# Altium schematic sheet LT3798.SchDoc
size A3
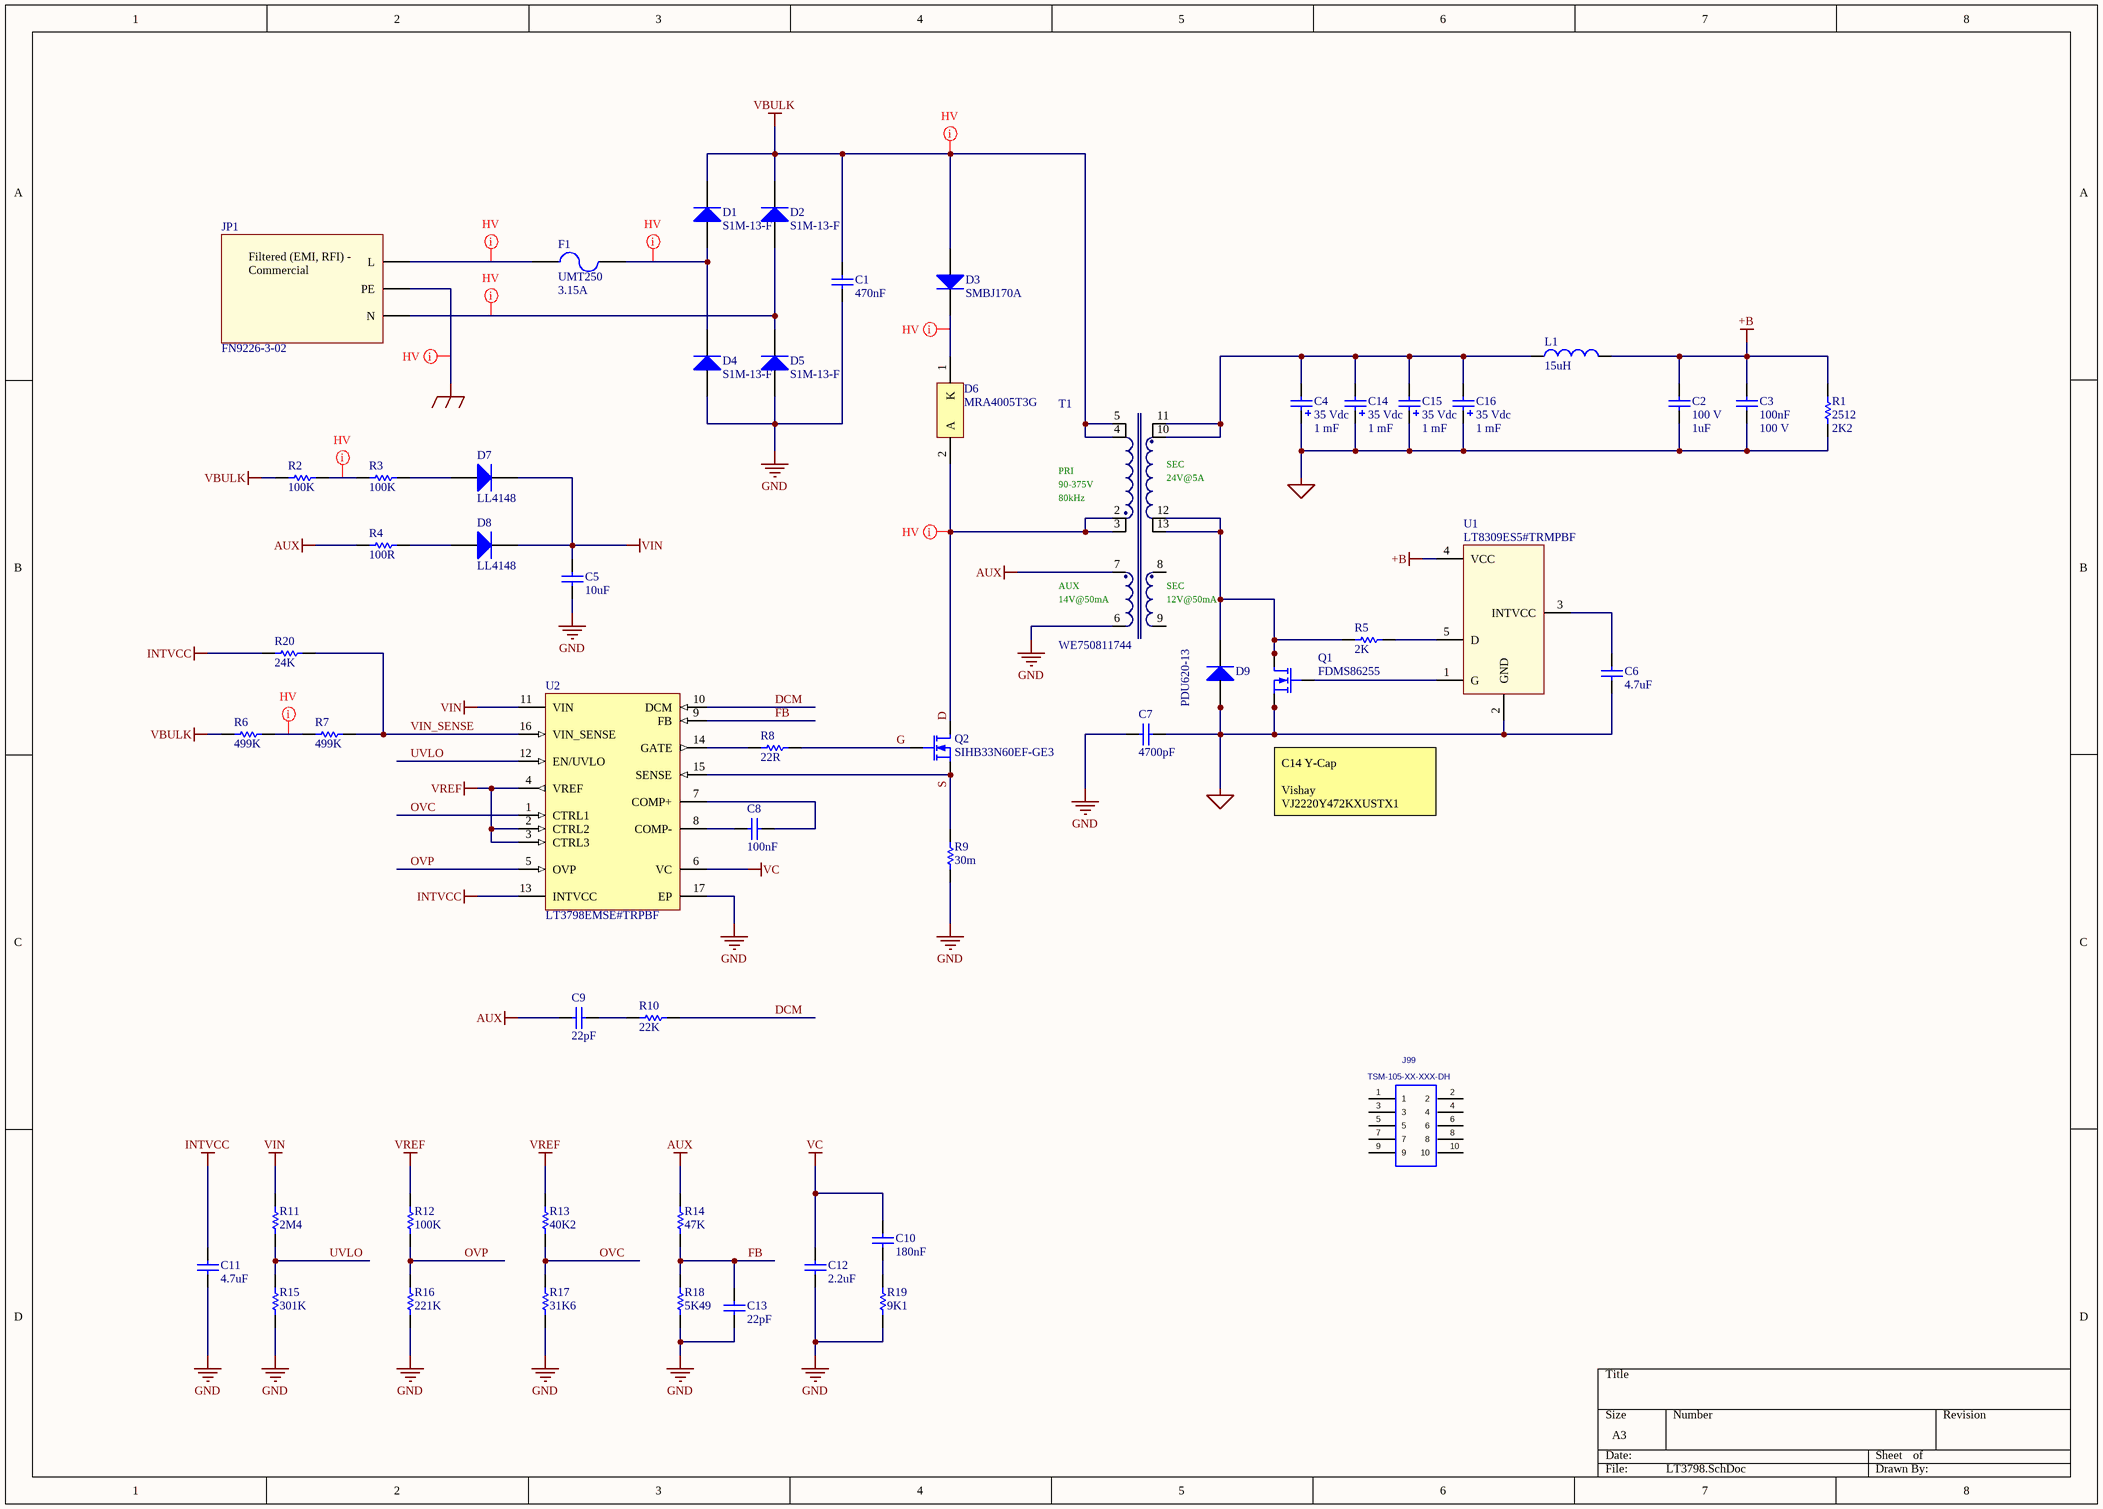
[diagram p0: LT3798.SchDoc]

## Parts
C1  470nF  [CAP_RM15_W9L18]
C2  value 1uF  Rated Voltage: 100 V  [CAPC1206(3216)190_L]  (hidden comment: CAP 1uF 100V 1206(3216))
C3  value 100nF  Rated Voltage: 100 V  [CAPC1206(3216)150_M]  (hidden comment: CAP 100nF 100V 1206(3216))
C4  value 1 mF  Rated Voltage: 35 Vdc  [WCAP-ATLL_10x30x5]  (hidden comment: 35 Vdc, 1 mF)
C5  value 10uF  [CAPC0805(2012)75_N]  (hidden comment: CAP)
C6  value 4.7uF  [CAPC0805(2012)75_N]  (hidden comment: CAP)
C7  value 4700pF  [CAP_VY2472M49Y5US63V7]  (hidden comment: VY2472M49Y5US63V7)
C8  value 100nF  [CAPC0805(2012)75_N]  (hidden comment: CAP)
C9  value 22pF  [CAPC0805(2012)75_N]  (hidden comment: CAP)
C10  value 180nF  [CAPC0805(2012)75_N]  (hidden comment: CAP)
C11  value 4.7uF  [CAPC0805(2012)75_N]  (hidden comment: CAP)
C12  value 2.2uF  [CAPC0805(2012)75_N]  (hidden comment: CAP)
C13  value 22pF  [CAPC0805(2012)75_N]  (hidden comment: CAP)
C14  value 1 mF  Rated Voltage: 35 Vdc  [WCAP-ATLL_10x30x5]  (hidden comment: 35 Vdc, 1 mF)
C15  value 1 mF  Rated Voltage: 35 Vdc  [WCAP-ATLL_10x30x5]  (hidden comment: 35 Vdc, 1 mF)
C16  value 1 mF  Rated Voltage: 35 Vdc  [WCAP-ATLL_10x30x5]  (hidden comment: 35 Vdc, 1 mF)
D1  S1M-13-F  [DIOD-S1M-13-F-SMA-2_V]
D2  S1M-13-F  [DIOD-S1M-13-F-SMA-2_V]
D3  SMBJ170A  [FAIR-DO-214AA-2_V]
D4  S1M-13-F  [DIOD-S1M-13-F-SMA-2_V]
D5  S1M-13-F  [DIOD-S1M-13-F-SMA-2_V]
D6  MRA4005T3G  [ONSC-SMA-2-403D-02_V]
D7  LL4148  [DIOD-SOD-80]
D8  LL4148  [DIOD-SOD-80]
D9  PDU620-13  [PowerDI5]
F1  UMT250  value 3.15A  [FUSE_UMT250]
J99  TSM-105-XX-XXX-DH  [TSM-105-XX-XXX-DH]
JP1  FN9226-3-02  [CONN-FN9226-3-02]
L1  value 15uH  [1D14A]  (hidden comment: 1D14A-150m)
Q1  FDMS86255  [POWER56]
Q2  SIHB33N60EF-GE3  [D2PAK_L]
R1  value 2K2  Case-EIA: 2512  [RESC2512(6432)_L]  (hidden comment: 2K2 5% 2512(6432))
R2  value 100K  [RESC1206(3216)_L]  (hidden comment: 100K 1% 1206(3216))
R3  value 100K  [RESC1206(3216)_L]  (hidden comment: 100K 1% 1206(3216))
R4  value 100R  [RESC0805(2012)_N]  (hidden comment: RES)
R5  value 2K  [RESC0805(2012)_N]  (hidden comment: RES)
R6  value 499K  [RESC1206(3216)_L]  (hidden comment: 499K 1% 1206(3216))
R7  value 499K  [RESC1206(3216)_L]  (hidden comment: 499K 1% 1206(3216))
R8  value 22R  [RESC0805(2012)_L]  (hidden comment: 22R 5% 0805(2012))
R9  value 30m  [RESC1206(3216)_N]  (hidden comment: RES)
R10  value 22K  [RESC0805(2012)_L]  (hidden comment: 22K 5% 0805(2012))
R11  value 2M4  [RESC0805(2012)_L]  (hidden comment: 2M4 1% 0805(2012))
R12  value 100K  [RESC0805(2012)_L]  (hidden comment: 100K 1% 0805(2012))
R13  value 40K2  [RESC0805(2012)_L]  (hidden comment: 40K2 1% 0805(2012))
R14  value 47K  [RESC0805(2012)_N]  (hidden comment: RES)
R15  value 301K  [RESC0805(2012)_L]  (hidden comment: 301K 1% 0805(2012))
R16  value 221K  [RESC0805(2012)_L]  (hidden comment: 221K 1% 0805(2012))
R17  value 31K6  [RESC0805(2012)_L]  (hidden comment: 31K6 1% 0805(2012))
R18  value 5K49  [RESC0805(2012)_N]  (hidden comment: RES)
R19  value 9K1  [RESC0805(2012)_N]  (hidden comment: RES)
R20  value 24K  [RESC0805(2012)_N]  (hidden comment: 24K 5% 0805(2012))
T1  WE750811744  [ETD34_5455]
U1  LT8309ES5#TRMPBF  [SOT23-5_L]
U2  LT3798EMSE#TRPBF  [LT-MSE-16-EDP_N]

## Nets
+B: C2.2 C3.2 L1.2 R1.2 U1.4(VCC)
AUX: C9.2 R4.2 R14.2 T1.7
GND: C1.1 C5.1 C7.1 C11.1 C12.1 C13.1 D4.1(A) D5.1(A) R9.1 R15.1 R16.1 R17.1 R18.1 R19.1 T1.6 U2.17(EP)
INTVCC: C11.2 R20.1 U2.13(INTVCC)
PE: JP1.PE
SGND: C2.1 C3.1 C4.1(P) C6.1 C7.2 C14.1(P) C15.1(P) C16.1(P) D9.1(A1) D9.2(A2) Q1.1(S) Q1.2(S) Q1.3(S) R1.1 U1.2(GND)
VBULK: C1.2 D1.2(K) D2.2(K) D3.1(A) R2.1 R6.1 T1.4 T1.5
VC: C10.2 C12.2 U2.6(VC)
VIN: C5.2 D7.2(K) D8.2(K) R11.2 U2.11(VIN)
VREF: R12.2 R13.2 U2.2(CTRL2) U2.3(CTRL3) U2.4(VREF)
D: D6.2(A) Q2.4(D) T1.2 T1.3
DCM: R10.2 U2.10(DCM)
FB: C13.2 R14.1 R18.2 U2.9(FB)
G: Q2.1(G) R8.2
OVC: R13.1 R17.2 U2.1(CTRL1)
OVP: R12.1 R16.2 U2.5(OVP)
S: Q2.3(S) R9.2 U2.15(SENSE)
UVLO: R11.1 R15.2 U2.12(EN/UVLO)
VIN_SENSE: R7.2 R20.2 U2.16(VIN_SENSE)
NetC4_2: C4.2(N) C14.2(N) C15.2(N) C16.2(N) L1.1 T1.10 T1.11
NetC6_2: C6.2 U1.3(INTVCC)
NetC8_1: C8.1 U2.7(COMP+)
NetC8_2: C8.2 U2.8(COMP-)
NetC9_1: C9.1 R10.1
NetC10_1: C10.1 R19.2
NetD1_1: D1.1(A) D4.2(K) F1.2
NetD2_1: D2.1(A) D5.2(K) JP1.N
NetD3_2: D3.2(K) D6.1(K)
NetD7_1: D7.1(A) R3.2
NetD8_1: D8.1(A) R4.1
NetD9_3: D9.3(K) Q1.5(D) Q1.6(D) Q1.7(D) Q1.8(D) Q1.EP(D) R5.1 T1.12 T1.13
NetF1_1: F1.1 JP1.L
NetQ1_4: Q1.4(G) U1.1(G)
NetR2_2: R2.2 R3.1
NetR5_2: R5.2 U1.5(D)
NetR6_2: R6.2 R7.1
NetR8_1: R8.1 U2.14(GATE)

Not connected (* = marked no-connect by the designer): J99 1 2 3 4 5 6 7 8 9 10; T1 8 9

## Layout directives
net class HV: D, NetD1_1, NetD2_1, NetD3_2, NetF1_1, NetR2_2, NetR6_2, PE, VBULK

## Notes on the sheet
- C14 Y-Cap
  Vishay
  VJ2220Y472KXUSTX1
- (in symbol CONN_FN9226-3-02) Filtered (EMI, RFI) - Commercial
- (in symbol TRANS_WE750811744) SEC; PRI; 24V@5A; 90-375V; 80kHz; AUX; 14V@50mA; 12V@50mA

## Library data of the parts
C1 = CAP_FILM_470NF_400V: CAP FILM 0.47UF 400VDC RADIAL; MPN: B32652A4474J189; PackageReference: RM15; Farnell: 2291756; Value: 470nF
C2 = CMP-1037-04729-1: CAP 1uF 100V ±20% 1206 (3216 Metric) Thickness 1.9mm SMD; Case-EIA: 1206; Case-Metric: 3216; Tolerance: Â±20%; Max Thickness: 1.9 mm; Technology: SMT
C3 = CMP-1037-04216-1: CAP 100nF 100V ±20% 1206 (3216 Metric) Thickness 1.45mm SMD; Case-Metric: 3216; Case-EIA: 1206; Tolerance: Â±20%; Max Thickness: 1.45 mm; Technology: SMT
C4 C14-C16 = 860160575031: WCAP-ATLL Aluminum Electrolytic Capacitors, 10x30mm, 35 Vdc, 1 mF; ComponentLink1Description: Manufacturer; ComponentLink1URL: http://www.we-online.de; ComponentLink2Description: Datasheet; ComponentLink2URL: http://katalog.we-online.com/pbs/datasheet/860160575031.pdf; Part Number: 860160575031; Published Date: Sep. 2017; Publisher: Wurth Elektronik; Size: 10x30mm; Life Cycle: 6000h; Operating Temperature: -55 °C up to +105 °C
C5 C6 C8-C13 = CAP: Generic capacitor non polarised
C7 = CAP_VY2_4700: 4700pF ±20% 440VAC Ceramic Capacitor Y5U (E) Radial, Disc; PackageReference: THD; FARNELL: 1902233; MPN: VY2472M49Y5US63V7; Voltage: 440VAC; DigiKey: BC2359-ND
D1 D2 D4 D5 = CMP-0639-00001-1: Surface Mount Glass Passivated Rectifier, 1000V, 1 A, -65 to 125 degC, 2-Pin SMA Package, RoHS, Tape and Reel; Manufacturer: Diodes Inc; Maximum Reverse Current IR (uA): 5; Maximum Peak Forward Surge Current IFSM (A): 30; Maximum Average Rectified Current IO (A): 1; Peak Repetitive Reverse Voltage VRRM (V): 1000; Total Capacitance CT (pF): 10; Forward Voltage Drop VF (V): 1.1; ComponentLink1URL: http://www.diodes.com/; Operating Temperature Range: -65 to 150 degC; ComponentLink3URL: http://diodes.com/datasheets/ds16003.pdf; ComponentLink3Description: Package Specification; PackageDescription: 2-Pin SMD, Body 4.3 x 2.605 mm, Height 2.3 mm; Mounting Technology: Surface Mount; ComponentLink1Description: Manufacturer URL; PackageReference: S1M-13-F-SMA-2; ComponentLink2URL: http://diodes.com/datasheets/ds16003.pdf; ComponentLink2Description: Datasheet; RoHS: TRUE; DatasheetVersion: Rev. 22 - 2; Packing: Tape and Reel; PackageVersion: Rev. 22 - 2; PartNumber: S1M-13-F
D3 = TVS-SMBJ170A: TVS DIODE 170V 353V SMB; Manufacturer: Fairchild Semiconductor; Unidirectional Channels: 1; EDA / CAD Models: DownloadfromAcceleratedDesigns; Type: Zener; Power - Peak Pulse: 600W; Power Line Protection: No; Online Catalog: SMBJSeries; Voltage - Breakdown (Min): 189V; Other Names: SMBJ12AFSDKR; Current - Peak Pulse (10/1000µs): 30.2A; Package / Case: DO-214AA,SMB; Mounting Technology: SurfaceMount; Standard Package: 1; Capacitance @ Frequency: -; Category: CircuitProtection; Supplier Device Package: DO-214AA(SMB); Mounting Type: SurfaceMount; Series: SMBJ; Voltage - Clamping (Max) @ Ipp: 353V; Family: TVS-Diodes; Datasheet Version: Rev. 1.1.1, 11/2014; Package Reference: DO-214AA-2; Package Description: 2-Pin Surface Mount Device, Body 4.4 x 3.625 mm; Packaging: Digi-Reel®; Bidirectional Channels: -; Manufacturer URL: https://www.fairchildsemi.com/; Applications: GeneralPurpose; Operating Temperature: -55°C~150°C(TJ); Voltage - Reverse Standoff (Typ): 170V; Datasheet URL: http://www.mouser.com/ds/2/149/SMBJ12A-196559.pdf
D6 = CMP-0894-00001-3: Surface Mount Standard Recovery Power Rectifier, 2-Pin SMA, Pb-Free, Tape and Reel; Manufacturer: On Semiconductor; VRRM Max (V): 600; IFSM Max (A): 30; IO(rec) Max (A): 1; RoHS: TRUE; PackageDescription: 2-Pin Small Molded Package, J-Bend Lead, Body 2.605 x 4.315 mm; ComponentLink1Description: Manufacturer URL; ComponentLink2Description: Datasheet; Packing: Tape and Reel; ComponentLink2URL: http://www.onsemi.com/pub_link/Collateral/MRA4003T3-D.PDF; DatasheetVersion: Rev. 9; ComponentLink3Description: Package Specification; Mounting Technology: Surface Mount; PackageReference: SMA-2-403D-02; ComponentLink1URL: http://www.onsemi.com/; ComponentLink3URL: http://www.onsemi.com/pub_link/Collateral/403D-02.PDF; PackageVersion: Rev. G, 07/2012; Type: Standard Recovery; PartNumber: MRA4005T3G
D7 D8 = DIOD_GP_LL4148: DIODE GEN PURP 100V 200MA SOD80; Code_JEDEC: SOD-80; FARNELL: 2101203; DigiKey: LL4148FSTR-ND; MPN: LL4148
D9 = DIOD_GP_PDU620-13: Diode Standard 200V 6A Surface Mount PowerDI™ 5; MPN: PDU620-13; DigiKey: PDU620DITR-ND; Farnell: 1713921
F1 = FUSE_UMT250-3.15A: Fuse; MPN: 3403.0171.11; ELFA: 13322670; Farnell: 1221095; DigiKey: 486-1252-ND
J99 = CONN-TSM-105-XX-XXX-DH: Terminal Strip, Dual Row Horizontal, Surface Mount, 0.100" Pitch, 10 Pins.; MANUFACTURER: SAMTEC; CREATED: July 11, 2014 - Wendy Xin; PCB DECAL: TSM-105-XX-XXX-DH
JP1 = CONN_FN9226-3-02: Power Entry Connector Receptacle, Male Blades IEC 320-C14 Panel Mount, Flange; Through Hole, Right Angle; MPN: FN9226-3-02
L1 = L-1D14A-150m: Fixed Inductors Class D Inductor 15uH 16mOhms; MPN: 1D14A-150m; Mouser: 911-1D14A-150M
Q1 = TRAN_FDMS86255: N-Channel 150V 10A (Ta), 45A (Tc) 2.7W (Ta), 113W (Tc) Surface Mount Power56; MPN: FDMS86255
Q2 = TRAN_SIHB33N60EF-GE3: N-Channel 600V 33A (Tc) 278W (Tc) Surface Mount D²PAK (TO-263); MPN: SIHB33N60EF-GE3
R1 = CMP-1018-00082-1: 2K2 1W 5% 2512 (6432 Metric)  SMD; Case-Metric: 6432; Technology: SMT; Power: 1 W; Tolerance: 5 %
R2 R3 = CMP-1014-00736-1: 100K 0.25W 1% 1206 (3216 Metric)  SMD; Case-EIA: 1206; Case-Metric: 3216; Tolerance: 1 %; Power: 0.25 W; Technology: SMT
R4 R5 R9 R14 R18 R19 = RES: Generic resistor
R6 R7 = CMP-1014-00815-1: 499K 0.25W 1% 1206 (3216 Metric)  SMD; Case-Metric: 3216; Case-EIA: 1206; Tolerance: 1 %; Technology: SMT; Power: 0.25 W
R8 = CMP-1013-00034-1: 22R 0.125W 5% 0805 (2012 Metric)  SMD; Case-Metric: 2012; Case-EIA: 0805; Power: 0.125 W; Technology: SMT; Tolerance: 5 %
R10 = CMP-1013-00106-1: 22K 0.125W 5% 0805 (2012 Metric)  SMD; Case-Metric: 2012; Case-EIA: 0805; Power: 0.125 W; Tolerance: 5 %; Technology: SMT
R11 = CMP-1013-00890-1: 2M4 0.125W 1% 0805 (2012 Metric)  SMD; Case-EIA: 0805; Case-Metric: 2012; Tolerance: 1 %; Power: 0.125 W; Technology: SMT
R12 = CMP-1013-00736-1: 100K 0.125W 1% 0805 (2012 Metric)  SMD; Case-Metric: 2012; Case-EIA: 0805; Tolerance: 1 %; Technology: SMT; Power: 0.125 W
R13 = CMP-1013-00691-1: 40K2 0.125W 1% 0805 (2012 Metric)  SMD; Case-EIA: 0805; Case-Metric: 2012; Technology: SMT; Tolerance: 1 %; Power: 0.125 W
R15 = CMP-1013-00789-1: 301K 0.125W 1% 0805 (2012 Metric)  SMD; Case-Metric: 2012; Case-EIA: 0805; Technology: SMT; Tolerance: 1 %; Power: 0.125 W
R16 = CMP-1013-00773-1: 221K 0.125W 1% 0805 (2012 Metric)  SMD; Case-Metric: 2012; Case-EIA: 0805; Technology: SMT; Tolerance: 1 %; Power: 0.125 W
R17 = CMP-1013-00678-1: 31K6 0.125W 1% 0805 (2012 Metric)  SMD; Case-EIA: 0805; Case-Metric: 2012; Tolerance: 1 %; Technology: SMT; Power: 0.125 W
R20 = CMP-1013-00107-1: 24K 0.125W 5% 0805 (2012 Metric)  SMD; Case-Metric: 2012; Case-EIA: 0805; Power: 0.125 W; Tolerance: 5 %; Technology: SMT
T1 = TRANS_WE750811744: MID-OLLT Offline Flyback Transformers for Linear Technology; MPN: 750811744
U1 = IC-PMIC-LT8309: MPN: LT8309ES5#TRMPBF
U2 = CMP-0491-01150-1: Isolated No Opto-Coupler Flyback Controller with Active PFC, 16-pin SOP (MSE-16-EDP), -40 to 125 degC, Pb-Free, Tape and Reel; Manufacturer: Linear Technology; Number of Outputs: 1; RoHS: TRUE; ComponentLink2URL: http://cds.linear.com/docs/en/datasheet/3798fa.pdf; Packing: Tape and Reel; ComponentLink2Description: Datasheet; ComponentLink1Description: Manufacturer URL; PartNumber: LT3798EMSE#TRPBF; Mounting Technology: Surface Mount; PackageVersion: Rev. F, 05/2013; PackageDescription: 16-Pin Plastic MSOP, Exposed Die Pad, Body 4.039 x 3 mm, Pitch 0.5 mm; PackageReference: MSE-16; ComponentLink3URL: http://cds.linear.com/docs/en/packaging/05081667_F_MSE16.pdf; DatasheetVersion: Rev. A; ComponentLink3Description: Package Specification; ComponentLink1URL: http://www.linear.com/